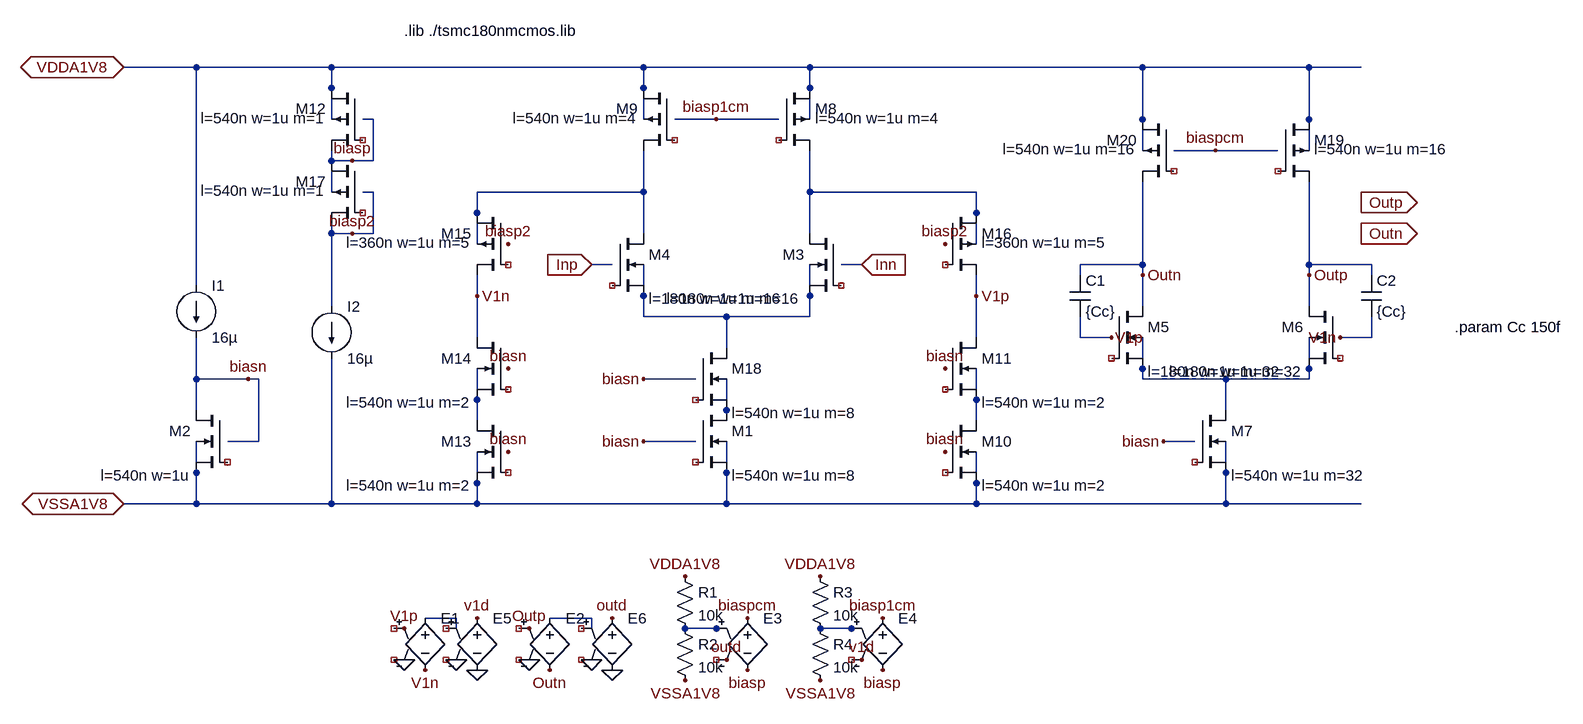
[diagram p0: schematic ping-pong-ota.asc]
ping-pong-ota.asc, the LTspice schematic file:
Version 4
SHEET 1 1528 680
WIRE -496 -352 -608 -352
WIRE -288 -352 -496 -352
WIRE 192 -352 -288 -352
WIRE 448 -352 192 -352
WIRE 960 -352 448 -352
WIRE 1216 -352 960 -352
WIRE 1296 -352 1216 -352
WIRE -288 -320 -288 -352
WIRE 192 -320 192 -352
WIRE 448 -320 448 -352
WIRE -288 -272 -288 -320
WIRE -224 -272 -240 -272
WIRE 192 -272 192 -320
WIRE 304 -272 240 -272
WIRE 400 -272 304 -272
WIRE 448 -272 448 -320
WIRE 960 -272 960 -352
WIRE 1216 -272 1216 -352
WIRE 960 -224 960 -272
WIRE 1072 -224 1008 -224
WIRE 1168 -224 1072 -224
WIRE 1216 -224 1216 -272
WIRE -288 -208 -288 -224
WIRE -256 -208 -288 -208
WIRE -224 -208 -224 -272
WIRE -224 -208 -256 -208
WIRE -288 -160 -288 -208
WIRE -224 -160 -240 -160
WIRE 192 -160 192 -224
WIRE 192 -160 -64 -160
WIRE 448 -160 448 -224
WIRE 704 -160 448 -160
WIRE -64 -128 -64 -160
WIRE 704 -128 704 -160
WIRE -288 -96 -288 -112
WIRE -256 -96 -288 -96
WIRE -224 -96 -224 -160
WIRE -224 -96 -256 -96
WIRE 192 -96 192 -160
WIRE 448 -96 448 -160
WIRE -64 -80 -64 -128
WIRE 704 -80 704 -128
WIRE 144 -48 112 -48
WIRE 528 -48 496 -48
WIRE 960 -48 960 -176
WIRE 960 -48 864 -48
WIRE 1216 -48 1216 -176
WIRE 1312 -48 1216 -48
WIRE 864 -32 864 -48
WIRE 960 -32 960 -48
WIRE 1216 -32 1216 -48
WIRE 1312 -32 1312 -48
WIRE -496 -16 -496 -352
WIRE -64 0 -64 -32
WIRE 192 0 192 -48
WIRE 448 0 448 -48
WIRE 704 0 704 -32
WIRE -288 16 -288 -96
WIRE 960 16 960 -32
WIRE 1216 16 1216 -32
WIRE 192 32 192 0
WIRE 320 32 192 32
WIRE 448 32 448 0
WIRE 448 32 320 32
WIRE -64 64 -64 0
WIRE 704 64 704 0
WIRE 864 64 864 32
WIRE 912 64 864 64
WIRE 1312 64 1312 32
WIRE 1312 64 1264 64
WIRE 320 80 320 32
WIRE 960 112 960 64
WIRE 1216 112 1216 64
WIRE -496 128 -496 64
WIRE -416 128 -496 128
WIRE -400 128 -416 128
WIRE 272 128 192 128
WIRE 960 128 960 112
WIRE 1088 128 960 128
WIRE 1216 128 1216 112
WIRE 1216 128 1088 128
WIRE -64 160 -64 112
WIRE 704 160 704 112
WIRE -496 176 -496 128
WIRE 320 176 320 128
WIRE 1088 176 1088 128
WIRE -64 192 -64 160
WIRE 704 192 704 160
WIRE -400 224 -400 128
WIRE -400 224 -448 224
WIRE 272 224 192 224
WIRE 1040 224 992 224
WIRE -496 272 -496 224
WIRE 320 272 320 224
WIRE 1088 272 1088 224
WIRE -64 288 -64 240
WIRE 704 288 704 240
WIRE -496 320 -496 272
WIRE -496 320 -608 320
WIRE -288 320 -288 96
WIRE -288 320 -496 320
WIRE -64 320 -64 288
WIRE -64 320 -288 320
WIRE 320 320 320 272
WIRE 320 320 -64 320
WIRE 704 320 704 288
WIRE 704 320 320 320
WIRE 1088 320 1088 272
WIRE 1088 320 704 320
WIRE 1296 320 1088 320
WIRE -96 496 -144 496
WIRE 112 496 48 496
WIRE -96 512 -96 496
WIRE 112 512 112 496
WIRE 320 512 256 512
WIRE 528 512 464 512
FLAG -608 -352 VDDA1V8
IOPIN -608 -352 BiDir
FLAG -608 320 VSSA1V8
IOPIN -608 320 BiDir
FLAG 112 -48 Inp
IOPIN 112 -48 In
FLAG 528 -48 Inn
IOPIN 528 -48 In
FLAG 1296 -144 Outp
IOPIN 1296 -144 Out
FLAG 1296 -96 Outn
IOPIN 1296 -96 Out
FLAG 912 64 V1p
FLAG 1264 64 V1n
FLAG 1216 -32 Outp
FLAG 960 -32 Outn
FLAG 192 224 biasn
FLAG 992 224 biasn
FLAG -256 -208 biasp
FLAG 304 -272 biasp1cm
FLAG -416 128 biasn
FLAG 656 240 biasn
FLAG 656 112 biasn
FLAG -16 240 biasn
FLAG -16 112 biasn
FLAG -64 0 V1n
FLAG 704 0 V1p
FLAG -256 -96 biasp2
FLAG -16 -80 biasp2
FLAG 656 -80 biasp2
FLAG 192 128 biasn
FLAG 1072 -224 biaspcm
FLAG -176 512 V1p
FLAG -144 576 V1n
FLAG 16 512 Outp
FLAG 48 576 Outn
FLAG -64 496 v1d
FLAG 144 496 outd
FLAG 320 560 outd
FLAG 352 576 biasp
FLAG 352 496 biaspcm
FLAG 256 592 VSSA1V8
FLAG 256 432 VDDA1V8
FLAG 528 560 v1d
FLAG 560 576 biasp
FLAG 560 496 biasp1cm
FLAG 464 592 VSSA1V8
FLAG 464 432 VDDA1V8
FLAG 16 560 0
FLAG -176 560 0
FLAG -96 560 0
FLAG -64 576 0
FLAG 112 560 0
FLAG 144 576 0
SYMBOL nmos4 272 176 R0
WINDOW 3 56 72 Invisible 2
WINDOW 123 56 100 Left 2
SYMATTR Value TSMC180nmN
SYMATTR Value2 l=540n w=1u m=8
SYMATTR InstName M1
SYMBOL nmos4 -448 176 M0
WINDOW 3 56 72 Invisible 2
WINDOW 123 56 100 Left 2
SYMATTR Value TSMC180nmN
SYMATTR Value2 l=540n w=1u
SYMATTR InstName M2
SYMBOL nmos4 496 -96 M0
WINDOW 3 56 72 Invisible 2
WINDOW 123 61 100 Left 2
SYMATTR Value TSMC180nmN
SYMATTR Value2 l=180n w=1u m=16
SYMATTR InstName M3
SYMBOL nmos4 144 -96 R0
WINDOW 3 56 72 Invisible 2
WINDOW 123 56 100 Left 2
WINDOW 39 56 128 Left 2
WINDOW 40 56 156 Left 2
SYMATTR Value TSMC180nmN
SYMATTR Value2 l=180n w=1u m=16
SYMATTR InstName M4
SYMBOL current -496 -16 R0
WINDOW 123 0 0 Left 0
WINDOW 39 0 0 Left 0
SYMATTR InstName I1
SYMATTR Value 16µ
SYMBOL nmos4 912 16 R0
WINDOW 3 56 72 Invisible 2
WINDOW 123 56 100 Left 2
WINDOW 39 56 128 Left 2
WINDOW 40 56 156 Left 2
SYMATTR Value TSMC180nmN
SYMATTR Value2 l=180n w=1u m=32
SYMATTR InstName M5
SYMBOL nmos4 1264 16 M0
WINDOW 3 56 72 Invisible 2
WINDOW 123 56 100 Left 2
WINDOW 39 56 128 Left 2
WINDOW 40 56 156 Left 2
SYMATTR Value TSMC180nmN
SYMATTR Value2 l=180n w=1u m=32
SYMATTR InstName M6
SYMBOL nmos4 1040 176 R0
WINDOW 3 56 72 Invisible 2
WINDOW 123 56 100 Left 2
SYMATTR Value TSMC180nmN
SYMATTR Value2 l=540n w=1u m=32
SYMATTR InstName M7
SYMBOL pmos4 400 -320 R0
WINDOW 3 56 72 Invisible 2
WINDOW 123 56 46 Left 2
SYMATTR InstName M8
SYMATTR Value TSMC180nmP
SYMATTR Value2 l=540n w=1u m=4
SYMBOL pmos4 240 -320 M0
WINDOW 3 56 72 Invisible 2
WINDOW 123 56 46 Left 2
SYMATTR InstName M9
SYMATTR Value TSMC180nmP
SYMATTR Value2 l=540n w=1u m=4
SYMBOL pmos4 -240 -320 M0
WINDOW 3 56 72 Invisible 2
WINDOW 123 56 46 Left 2
SYMATTR InstName M12
SYMATTR Value TSMC180nmP
SYMATTR Value2 l=540n w=1u m=1
SYMBOL current -288 16 R0
WINDOW 123 0 0 Left 0
WINDOW 39 0 0 Left 0
SYMATTR InstName I2
SYMATTR Value 16µ
SYMBOL nmos4 656 192 R0
WINDOW 3 56 72 Invisible 2
WINDOW 123 56 100 Left 2
SYMATTR Value TSMC180nmN
SYMATTR Value2 l=540n w=1u m=2
SYMATTR InstName M10
SYMBOL nmos4 656 64 R0
WINDOW 3 56 72 Invisible 2
WINDOW 123 56 100 Left 2
SYMATTR Value TSMC180nmN
SYMATTR Value2 l=540n w=1u m=2
SYMATTR InstName M11
SYMBOL nmos4 -16 192 M0
WINDOW 3 56 72 Invisible 2
WINDOW 123 56 100 Left 2
SYMATTR Value TSMC180nmN
SYMATTR Value2 l=540n w=1u m=2
SYMATTR InstName M13
SYMBOL nmos4 -16 64 M0
WINDOW 3 56 72 Invisible 2
WINDOW 123 56 100 Left 2
SYMATTR Value TSMC180nmN
SYMATTR Value2 l=540n w=1u m=2
SYMATTR InstName M14
SYMBOL pmos4 -16 -128 M0
WINDOW 3 56 72 Invisible 2
WINDOW 123 56 46 Left 2
SYMATTR InstName M15
SYMATTR Value TSMC180nmP
SYMATTR Value2 l=360n w=1u m=5
SYMBOL pmos4 656 -128 R0
WINDOW 3 56 72 Invisible 2
WINDOW 123 56 46 Left 2
SYMATTR InstName M16
SYMATTR Value TSMC180nmP
SYMATTR Value2 l=360n w=1u m=5
SYMBOL pmos4 -240 -208 M0
WINDOW 3 56 72 Invisible 2
WINDOW 123 56 46 Left 2
SYMATTR InstName M17
SYMATTR Value TSMC180nmP
SYMATTR Value2 l=540n w=1u m=1
SYMBOL nmos4 272 80 R0
WINDOW 3 56 72 Invisible 2
WINDOW 123 56 100 Left 2
SYMATTR Value TSMC180nmN
SYMATTR Value2 l=540n w=1u m=8
SYMATTR InstName M18
SYMBOL pmos4 1168 -272 R0
WINDOW 3 56 72 Invisible 2
WINDOW 123 56 46 Left 2
SYMATTR InstName M19
SYMATTR Value TSMC180nmP
SYMATTR Value2 l=540n w=1u m=16
SYMBOL pmos4 1008 -272 M0
WINDOW 3 56 72 Invisible 2
WINDOW 123 56 46 Left 2
SYMATTR InstName M20
SYMATTR Value TSMC180nmP
SYMATTR Value2 l=540n w=1u m=16
SYMBOL e -144 480 R0
WINDOW 3 23 80 Invisible 2
SYMATTR InstName E1
SYMATTR Value 1
SYMBOL e 48 480 R0
WINDOW 3 23 80 Invisible 2
SYMATTR InstName E2
SYMATTR Value 1
SYMBOL e 352 480 R0
WINDOW 3 23 80 Invisible 2
SYMATTR InstName E3
SYMATTR Value -1
SYMBOL res 240 416 R0
SYMATTR InstName R1
SYMATTR Value 10k
SYMBOL res 240 496 R0
SYMATTR InstName R2
SYMATTR Value 10k
SYMBOL e 560 480 R0
WINDOW 3 23 80 Invisible 2
SYMATTR InstName E4
SYMATTR Value -1
SYMBOL res 448 416 R0
SYMATTR InstName R3
SYMATTR Value 10k
SYMBOL res 448 496 R0
SYMATTR InstName R4
SYMATTR Value 10k
SYMBOL e -64 480 R0
WINDOW 3 23 80 Invisible 2
SYMATTR InstName E5
SYMATTR Value 0.5
SYMBOL e 144 480 R0
WINDOW 3 23 80 Invisible 2
SYMATTR InstName E6
SYMATTR Value 0.5
SYMBOL cap 848 -32 R0
SYMATTR InstName C1
SYMATTR Value {Cc}
SYMBOL cap 1296 -32 R0
SYMATTR InstName C2
SYMATTR Value {Cc}
TEXT -176 -408 Left 2 !.lib ./tsmc180nmcmos.lib
TEXT 1440 48 Left 2 !.param Cc 150f

The netlist it stands for:
* ping-pong-ota.asc
* M1: TSMC180nmN l=540n w=1u m=8 (symbol nmos4 not certain, pin order unknown); nets seen at it: N007, VSSA1V8
* M2: TSMC180nmN l=540n w=1u (symbol nmos4 not certain, pin order unknown); nets seen at it: biasn, VSSA1V8
* M3: TSMC180nmN l=180n w=1u m=16 (symbol nmos4 not certain, pin order unknown); nets seen at it: N002, N003
* M4: TSMC180nmN l=180n w=1u m=16 (symbol nmos4 not certain, pin order unknown); nets seen at it: N001, N003
I1 VDDA1V8 biasn 16µ
M5 Outn NC_05 N004 N004 TSMC180nmN l=180n w=1u m=32
M6 Outp NC_06 N004 N004 TSMC180nmN l=180n w=1u m=32
* M7: TSMC180nmN l=540n w=1u m=32 (symbol nmos4 not certain, pin order unknown); nets seen at it: N004, VSSA1V8
* M8: TSMC180nmP l=540n w=1u m=4 (symbol pmos4 not certain, pin order unknown); nets seen at it: N002, VDDA1V8
* M9: TSMC180nmP l=540n w=1u m=4 (symbol pmos4 not certain, pin order unknown); nets seen at it: N001, VDDA1V8
* M12: TSMC180nmP l=540n w=1u m=1 (symbol pmos4 not certain, pin order unknown); nets seen at it: biasp, VDDA1V8
I2 biasp2 VSSA1V8 16µ
* M10: TSMC180nmN l=540n w=1u m=2 (symbol nmos4 not certain, pin order unknown); nets seen at it: N006, VSSA1V8
* M11: TSMC180nmN l=540n w=1u m=2 (symbol nmos4 not certain, pin order unknown); nets seen at it: N006, V1p
* M13: TSMC180nmN l=540n w=1u m=2 (symbol nmos4 not certain, pin order unknown); nets seen at it: N005, VSSA1V8
* M14: TSMC180nmN l=540n w=1u m=2 (symbol nmos4 not certain, pin order unknown); nets seen at it: N005, V1n
* M15: TSMC180nmP l=360n w=1u m=5 (symbol pmos4 not certain, pin order unknown); nets seen at it: N001, V1n
* M16: TSMC180nmP l=360n w=1u m=5 (symbol pmos4 not certain, pin order unknown); nets seen at it: N002, V1p
* M17: TSMC180nmP l=540n w=1u m=1 (symbol pmos4 not certain, pin order unknown); nets seen at it: biasp, biasp2
* M18: TSMC180nmN l=540n w=1u m=8 (symbol nmos4 not certain, pin order unknown); nets seen at it: N003, N007
* M19: TSMC180nmP l=540n w=1u m=16 (symbol pmos4 not certain, pin order unknown); nets seen at it: Outp, VDDA1V8
* M20: TSMC180nmP l=540n w=1u m=16 (symbol pmos4 not certain, pin order unknown); nets seen at it: Outn, VDDA1V8
* E1: 1 (symbol e not certain, pin order unknown); nets seen at it: N008, V1n
* E2: 1 (symbol e not certain, pin order unknown); nets seen at it: N009, Outn
* E3: -1 (symbol e not certain, pin order unknown); nets seen at it: biasp, biaspcm, N010
R1 VDDA1V8 N010 10k
R2 N010 VSSA1V8 10k
* E4: -1 (symbol e not certain, pin order unknown); nets seen at it: biasp, biasp1cm, N011
R3 VDDA1V8 N011 10k
R4 N011 VSSA1V8 10k
* E5: 0.5 (symbol e not certain, pin order unknown); nets seen at it: 0, v1d
* E6: 0.5 (symbol e not certain, pin order unknown); nets seen at it: 0, outd
C1 Outn V1p {Cc}
C2 Outp V1n {Cc}
.model NMOS NMOS
.model PMOS PMOS
.lib standard.mos
.lib ./tsmc180nmcmos.lib
.param Cc 150f
.backanno
.end